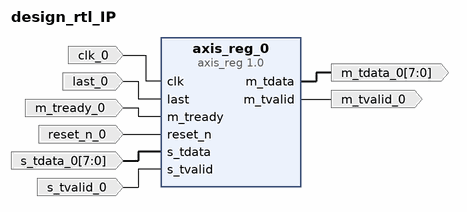
[diagram p0: block diagram of the top level]
# Vivado block design design_rtl_IP, xczu7ev-ffvc1156-2-e, Vivado 2022.2.2
create_bd_design design_rtl_IP

create_bd_port -dir O m_tvalid_0
create_bd_port -dir O -from 7 -to 0 m_tdata_0
create_bd_port -dir I -type rst reset_n_0
create_bd_port -dir I -type clk clk_0
create_bd_port -dir I -from 7 -to 0 s_tdata_0
create_bd_port -dir I s_tvalid_0
create_bd_port -dir I last_0
create_bd_port -dir I m_tready_0

create_bd_cell -type ip -vlnv user.org:user:axis_reg:1.0 axis_reg_0

# ---- connections ----

connect_bd_net [get_bd_pins axis_reg_0/m_tdata] [get_bd_ports m_tdata_0]
connect_bd_net [get_bd_pins axis_reg_0/m_tvalid] [get_bd_ports m_tvalid_0]
connect_bd_net -net clk_0_1 [get_bd_ports clk_0] [get_bd_pins axis_reg_0/clk]
connect_bd_net -net last_0_1 [get_bd_ports last_0] [get_bd_pins axis_reg_0/last]
connect_bd_net -net m_tready_0_1 [get_bd_ports m_tready_0] [get_bd_pins axis_reg_0/m_tready]
connect_bd_net -net reset_n_0_1 [get_bd_ports reset_n_0] [get_bd_pins axis_reg_0/reset_n]
connect_bd_net -net s_tdata_0_1 [get_bd_ports s_tdata_0] [get_bd_pins axis_reg_0/s_tdata]
connect_bd_net -net s_tvalid_0_1 [get_bd_ports s_tvalid_0] [get_bd_pins axis_reg_0/s_tvalid]

validate_bd_design
save_bd_design
